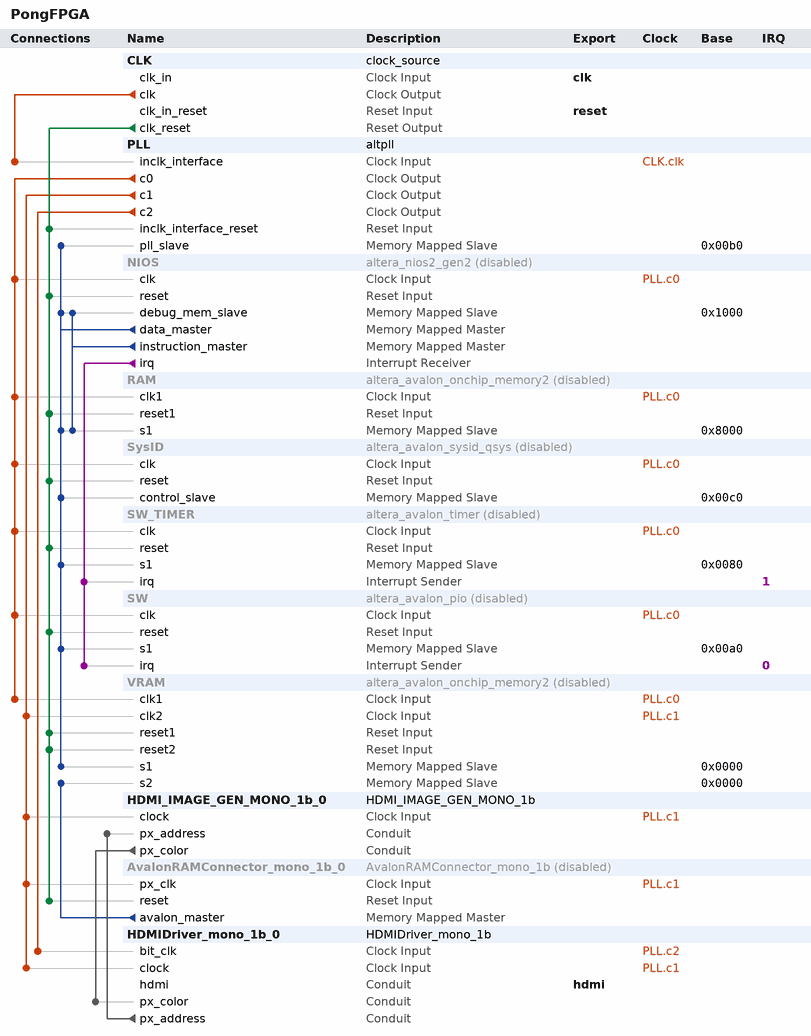
[diagram p0: system contents]
# Platform Designer (Qsys) system PongFPGA, MAX 10 10M08DAF256C8G
# Parameters at their usual value, and those the tool derives, are not listed.
package require -exact qsys 18.1
create_system PongFPGA
set_project_property DEVICE_FAMILY {MAX 10}
set_project_property DEVICE 10M08DAF256C8G

add_instance CLK clock_source 18.1
set_instance_parameter_value CLK clockFrequency 10000000

add_instance PLL altpll 18.1
set_instance_parameter_value PLL CLK0_DIVIDE_BY 1
set_instance_parameter_value PLL CLK0_MULTIPLY_BY 5
set_instance_parameter_value PLL CLK1_DIVIDE_BY 2
set_instance_parameter_value PLL CLK1_DUTY_CYCLE 50
set_instance_parameter_value PLL CLK1_MULTIPLY_BY 5
set_instance_parameter_value PLL CLK1_PHASE_SHIFT 0
set_instance_parameter_value PLL CLK2_DIVIDE_BY 1
set_instance_parameter_value PLL CLK2_DUTY_CYCLE 50
set_instance_parameter_value PLL CLK2_MULTIPLY_BY 25
set_instance_parameter_value PLL CLK2_PHASE_SHIFT 0
set_instance_parameter_value PLL INCLK0_INPUT_FREQUENCY 100000
set_instance_parameter_value PLL PORT_ARESET PORT_UNUSED
set_instance_parameter_value PLL PORT_LOCKED PORT_UNUSED
set_instance_parameter_value PLL PORT_clk1 PORT_USED
set_instance_parameter_value PLL PORT_clk2 PORT_USED
set_instance_parameter_value PLL PORT_clk3 PORT_UNUSED

add_instance NIOS altera_nios2_gen2 18.1
set_instance_property NIOS ENABLED false
set_instance_parameter_value NIOS dcache_size 2048
set_instance_parameter_value NIOS exceptionSlave RAM.s1
set_instance_parameter_value NIOS icache_size 4096
set_instance_parameter_value NIOS impl Tiny
set_instance_parameter_value NIOS resetSlave RAM.s1

add_instance RAM altera_avalon_onchip_memory2 18.1
set_instance_property RAM ENABLED false
set_instance_parameter_value RAM dataWidth 32
set_instance_parameter_value RAM dualPort false
set_instance_parameter_value RAM initMemContent false
set_instance_parameter_value RAM initializationFileName onchip_mem.hex
set_instance_parameter_value RAM memorySize 16384

add_instance SysID altera_avalon_sysid_qsys 18.1
set_instance_property SysID ENABLED false
set_instance_parameter_value SysID id 305419896

add_instance SW_TIMER altera_avalon_timer 18.1
set_instance_property SW_TIMER ENABLED false
set_instance_parameter_value SW_TIMER alwaysRun true
set_instance_parameter_value SW_TIMER fixedPeriod true
set_instance_parameter_value SW_TIMER period 1
set_instance_parameter_value SW_TIMER periodUnits MSEC

add_instance SW altera_avalon_pio 18.1
set_instance_property SW ENABLED false
set_instance_parameter_value SW captureEdge true
set_instance_parameter_value SW direction Input
set_instance_parameter_value SW edgeType FALLING
set_instance_parameter_value SW generateIRQ true
set_instance_parameter_value SW irqType EDGE
set_instance_parameter_value SW width 3

add_instance VRAM altera_avalon_onchip_memory2 18.1
set_instance_property VRAM ENABLED false
set_instance_parameter_value VRAM dataWidth 8
set_instance_parameter_value VRAM dualPort true
set_instance_parameter_value VRAM initMemContent false
set_instance_parameter_value VRAM initializationFileName D:/Dokumenty/Pulpit/programming_stuff/projekty_wersje_ostateczne/PongFPGA/Source/Hardware/simulation/simulationFiles/StaticImage.mif
set_instance_parameter_value VRAM memorySize 96

add_instance HDMI_IMAGE_GEN_MONO_1b_0 HDMI_IMAGE_GEN_MONO_1b 1.0
set_instance_parameter_value HDMI_IMAGE_GEN_MONO_1b_0 REG_LEN 5
set_instance_parameter_value HDMI_IMAGE_GEN_MONO_1b_0 VEL 1
set_instance_parameter_value HDMI_IMAGE_GEN_MONO_1b_0 X_RES 640
set_instance_parameter_value HDMI_IMAGE_GEN_MONO_1b_0 Y_RES 480

add_instance AvalonRAMConnector_mono_1b_0 AvalonRAMConnector_mono_1b 1.0
set_instance_property AvalonRAMConnector_mono_1b_0 ENABLED false
set_instance_parameter_value AvalonRAMConnector_mono_1b_0 DISPLAY_RES_HEIGHT 480
set_instance_parameter_value AvalonRAMConnector_mono_1b_0 DISPLAY_RES_WIDTH 640
set_instance_parameter_value AvalonRAMConnector_mono_1b_0 PX_X_SPLIT 20
set_instance_parameter_value AvalonRAMConnector_mono_1b_0 PX_Y_SPLIT 20

add_instance HDMIDriver_mono_1b_0 HDMIDriver_mono_1b 1.0
set_instance_parameter_value HDMIDriver_mono_1b_0 DISPLAY_RES_HEIGHT 480
set_instance_parameter_value HDMIDriver_mono_1b_0 DISPLAY_RES_WIDTH 640
set_instance_parameter_value HDMIDriver_mono_1b_0 PX_BACK_PORCH 48
set_instance_parameter_value HDMIDriver_mono_1b_0 PX_FRONT_PORCH 16
set_instance_parameter_value HDMIDriver_mono_1b_0 PX_SYNC_PULSE 96
set_instance_parameter_value HDMIDriver_mono_1b_0 ROW_BACK_PORCH 33
set_instance_parameter_value HDMIDriver_mono_1b_0 ROW_FRONT_PORCH 10
set_instance_parameter_value HDMIDriver_mono_1b_0 ROW_SYNC_PULSE 2

# connections
add_connection CLK.clk PLL.inclk_interface clock
add_connection PLL.c0 NIOS.clk clock
add_connection PLL.c0 RAM.clk1 clock
add_connection PLL.c0 SW.clk clock
add_connection PLL.c0 SW_TIMER.clk clock
add_connection PLL.c0 SysID.clk clock
add_connection PLL.c0 VRAM.clk1 clock
add_connection PLL.c1 AvalonRAMConnector_mono_1b_0.px_clk clock
add_connection PLL.c1 HDMI_IMAGE_GEN_MONO_1b_0.clock clock
add_connection PLL.c1 HDMIDriver_mono_1b_0.clock clock
add_connection PLL.c1 VRAM.clk2 clock
add_connection PLL.c2 HDMIDriver_mono_1b_0.bit_clk clock
add_connection CLK.clk_reset AvalonRAMConnector_mono_1b_0.reset reset
add_connection CLK.clk_reset NIOS.reset reset
add_connection CLK.clk_reset PLL.inclk_interface_reset reset
add_connection CLK.clk_reset RAM.reset1 reset
add_connection CLK.clk_reset SW.reset reset
add_connection CLK.clk_reset SW_TIMER.reset reset
add_connection CLK.clk_reset SysID.reset reset
add_connection CLK.clk_reset VRAM.reset1 reset
add_connection CLK.clk_reset VRAM.reset2 reset
add_connection AvalonRAMConnector_mono_1b_0.avalon_master VRAM.s2 avalon
set_connection_parameter_value AvalonRAMConnector_mono_1b_0.avalon_master/VRAM.s2 baseAddress 0x0000
add_connection NIOS.data_master NIOS.debug_mem_slave avalon
set_connection_parameter_value NIOS.data_master/NIOS.debug_mem_slave baseAddress 0x1000
add_connection NIOS.data_master PLL.pll_slave avalon
set_connection_parameter_value NIOS.data_master/PLL.pll_slave baseAddress 0x00b0
add_connection NIOS.data_master RAM.s1 avalon
set_connection_parameter_value NIOS.data_master/RAM.s1 baseAddress 0x8000
add_connection NIOS.data_master SW.s1 avalon
set_connection_parameter_value NIOS.data_master/SW.s1 baseAddress 0x00a0
add_connection NIOS.data_master SW_TIMER.s1 avalon
set_connection_parameter_value NIOS.data_master/SW_TIMER.s1 baseAddress 0x0080
add_connection NIOS.data_master SysID.control_slave avalon
set_connection_parameter_value NIOS.data_master/SysID.control_slave baseAddress 0x00c0
add_connection NIOS.data_master VRAM.s1 avalon
set_connection_parameter_value NIOS.data_master/VRAM.s1 baseAddress 0x0000
add_connection NIOS.instruction_master NIOS.debug_mem_slave avalon
set_connection_parameter_value NIOS.instruction_master/NIOS.debug_mem_slave baseAddress 0x1000
add_connection NIOS.instruction_master RAM.s1 avalon
set_connection_parameter_value NIOS.instruction_master/RAM.s1 baseAddress 0x8000
add_connection HDMI_IMAGE_GEN_MONO_1b_0.px_color HDMIDriver_mono_1b_0.px_color conduit
add_connection HDMIDriver_mono_1b_0.px_address HDMI_IMAGE_GEN_MONO_1b_0.px_address conduit
add_connection NIOS.irq SW.irq interrupt
set_connection_parameter_value NIOS.irq/SW.irq irqNumber 0
add_connection NIOS.irq SW_TIMER.irq interrupt
set_connection_parameter_value NIOS.irq/SW_TIMER.irq irqNumber 1

# exported interfaces
add_interface clk clock sink
set_interface_property clk EXPORT_OF CLK.clk_in
add_interface hdmi conduit end
set_interface_property hdmi EXPORT_OF HDMIDriver_mono_1b_0.hdmi
add_interface reset reset sink
set_interface_property reset EXPORT_OF CLK.clk_in_reset

set_interconnect_requirement {$system} qsys_mm.clockCrossingAdapter HANDSHAKE
set_interconnect_requirement {$system} qsys_mm.enableEccProtection FALSE
set_interconnect_requirement {$system} qsys_mm.insertDefaultSlave FALSE
set_interconnect_requirement {$system} qsys_mm.maxAdditionalLatency 1

save_system PongFPGA.qsys
